# EasyEDA Pro project F405_飞控mini_2025-11-19.epro

# Schematic F405mini飞控原理图
Board Name: 飞控mini; Create Date: 2025-03-17; Page Name: mini; Project Name: F405空心杯飞控; Schematic Name: F405mini飞控原理图; Update Date: 2025-11-16; Company: 嘉立创EDA; Page Size: A4; Version: V1.0
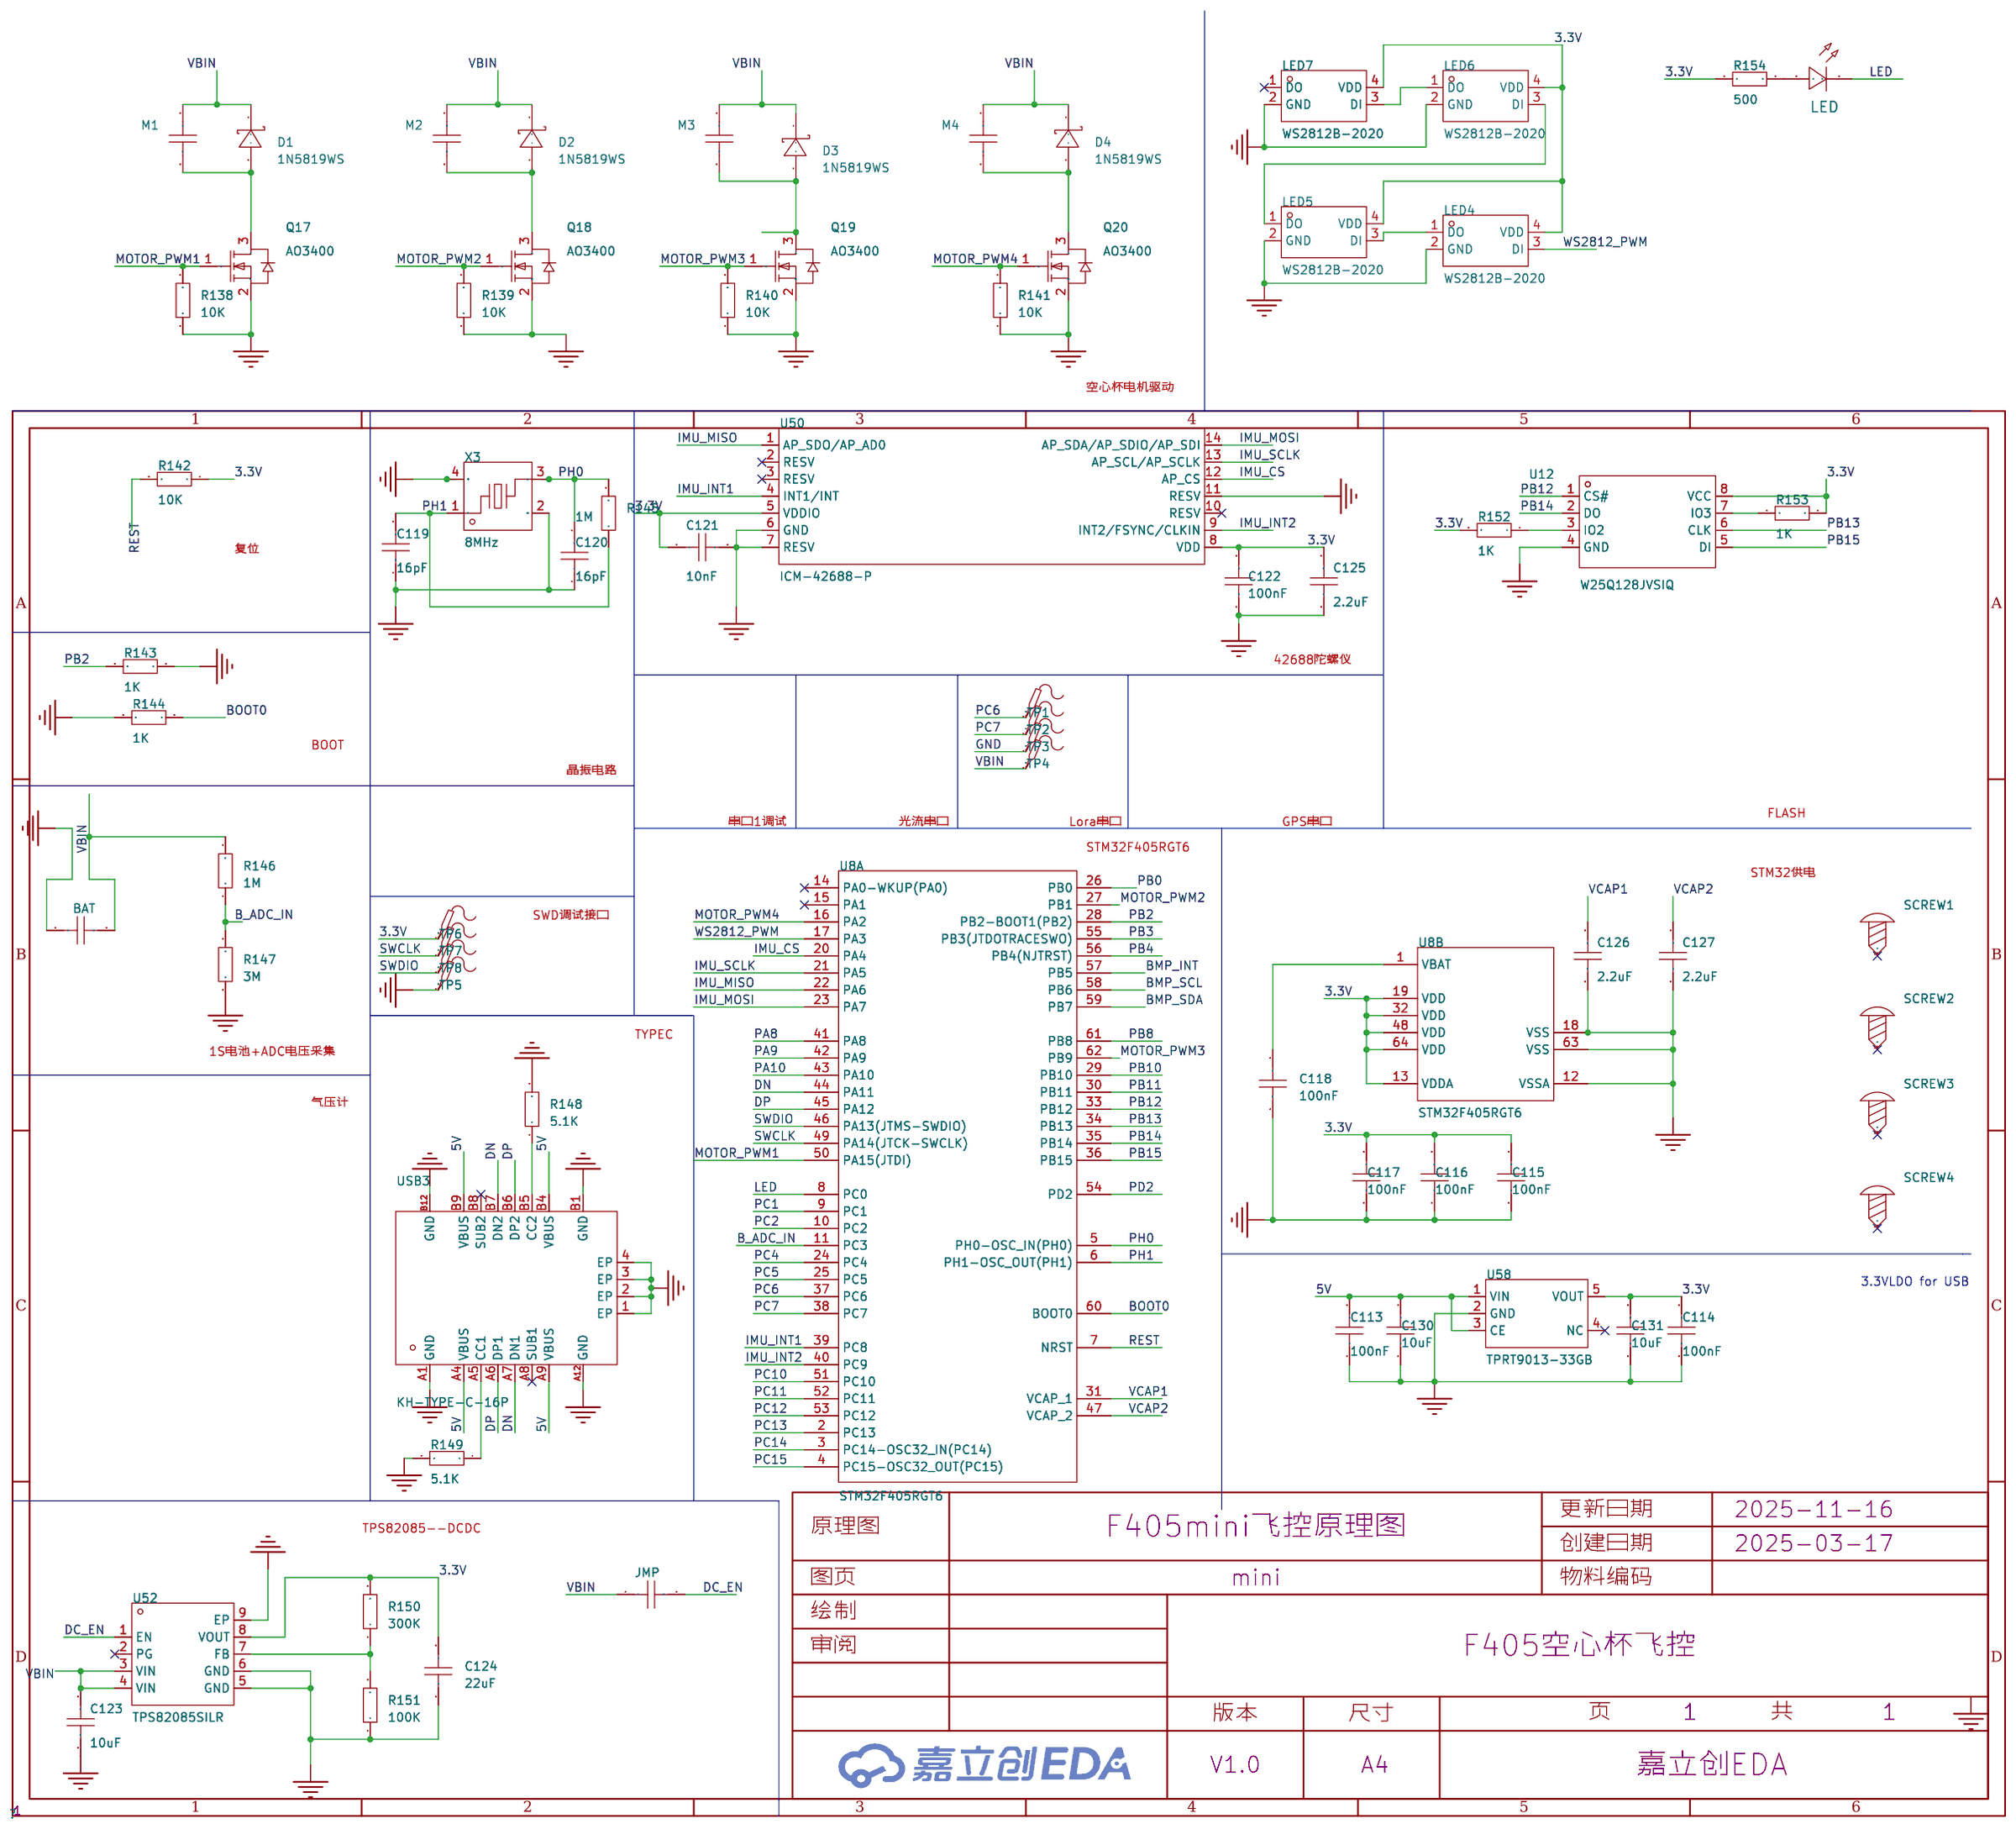
[diagram p0: schematic sheet]

## Parts
BAT  3.9nF  [C1812]
C113  100nF  [C0402]
C114  100nF  [C0402]
C115  100nF  [C0402]
C116  100nF  [C0402]
C117  100nF  [C0402]
C118  100nF  [C0402]
C119  16pF  [C0402]
C120  16pF  [C0402]
C121  10nF  [C0402]
C122  100nF  [C0402]
C123  10uF  [C0402]
C124  22uF  [C0603]
C125  2.2uF  [C0402]
C126  2.2uF  [C0402]
C127  2.2uF  [C0402]
C130  10uF  [C0402]
C131  10uF  [C0402]
D1  1N5819WS  [SOD-323_L1.8-W1.3-LS2.5-RD]
D2  1N5819WS  [SOD-323_L1.8-W1.3-LS2.5-RD]
D3  1N5819WS  [SOD-323_L1.8-W1.3-LS2.5-RD]
D4  1N5819WS  [SOD-323_L1.8-W1.3-LS2.5-RD]
JMP  100nF  [C0805]
LED  -  [LED_0603]
LED4  WS2812B-2020  [LED-SMD_4P-L2.0-W2.0-TL_WS2812B-2020]
LED5  WS2812B-2020  [LED-SMD_4P-L2.0-W2.0-TL_WS2812B-2020]
LED6  WS2812B-2020  [LED-SMD_4P-L2.0-W2.0-TL_WS2812B-2020]
LED7  WS2812B-2020  [LED-SMD_4P-L2.0-W2.0-TL_WS2812B-2020]
M1  100nF  [C1206]
M2  100nF  [C1206]
M3  100nF  [C1206]
M4  100nF  [C1206]
Q17  AO3400  [SOT-23_L2.9-W1.3-P1.90-LS2.4-BR]
Q18  AO3400  [SOT-23_L2.9-W1.3-P1.90-LS2.4-BR]
Q19  AO3400  [SOT-23_L2.9-W1.3-P1.90-LS2.4-BR]
Q20  AO3400  [SOT-23_L2.9-W1.3-P1.90-LS2.4-BR]
R138  10K  [R0402]
R139  10K  [R0402]
R140  10K  [R0402]
R141  10K  [R0402]
R142  10K  [R0402]
R143  1K  [R0402]
R144  1K  [R0402]
R145  1M  [R0402]
R146  1M  [R0402]
R147  3M  [R0402]
R148  5.1K  [R0402]
R149  5.1K  [R0402]
R150  300K  [R0402]
R151  100K  [R0402]
R152  1K  [R0402]
R153  1K  [R0402]
R154  500  [R0402]
SCREW1  -  [M2螺丝]
SCREW2  -  [M2螺丝]
SCREW3  -  [M2螺丝]
SCREW4  -  [M2螺丝]
TP1  -  [Test-Point-0.5mm]
TP2  -  [Test-Point-0.5mm]
TP3  -  [Test-Point-0.5mm]
TP4  -  [Test-Point-0.5mm]
TP5  -  [Test-Point-0.5mm]
TP6  -  [Test-Point-0.5mm]
TP7  -  [Test-Point-0.5mm]
TP8  -  [Test-Point-0.5mm]
U8  STM32F405RGT6  [LQFP-64_L10.0-W10.0-P0.50-LS12.0-BL]  (sections 1,2)
U12  W25Q128JVSIQ  [SOIC-8_L5.3-W5.3-P1.27-LS8.0-BL]
U50  ICM-42688-P  [LGA-14_L3.0-W2.5-P0.50-TL]
U52  TPS82085SILR  [USIP-8_L3.0-W2.8-P0.65-BL-EP]
U58  TPRT9013-33GB  [SOT-23-5_L3.0-W1.7-P0.95-LS2.8-BL]
USB3  KH-TYPE-C-16P  [USB-C-SMD_KH-TYPE-C-16P]
X3  8MHz  [CRYSTAL-SMD_4P-L3.2-W2.5-BL]

## Library data of the parts
BAT = FV43X392K202EFG: 容值:3.9nF;精度:±10%;额定电压:2kV;温度系数:X7R;; LCSC Part Name: 3.9nF ±10% 2kV; Supplier Part: C5144754; Manufacturer: PSA(信昌电陶); Supplier Footprint: 1812; JLCPCB Part Class: 扩展库; Datasheet: https://item.szlcsc.com/datasheet/FV43X392K202EFG/5766328.html; Supplier: LCSC; Tolerance: ±10%; Voltage Rating: 2kV; Temperature Coefficient: X7R
C113-C123 C125-C127 C130 C131 = CAP_0402: Supplier Footprint: 0402
C124 = CAP_0603: Supplier Footprint: 0603
D1-D4 = 1N5819WS_C191023: 正向压降(Vf):600mV@1A;直流反向耐压(Vr):40V;整流电流:1A;; LCSC Part Name: 电压:40V 电流:1A; Supplier Part: C191023; Manufacturer: Hottech(合科泰); Supplier Footprint: SOD-323; JLCPCB Part Class: 基础库; Datasheet: https://item.szlcsc.com/datasheet/1N5819WS/213850.html; Supplier: LCSC; Voltage - Forward(Vf@If): 600mV@1A; Voltage - DC Reverse(Vr): 40V; Current - Rectified: 1A; Non-Repetitive Peak Forward Surge Current: 25A
JMP = CAP_0805: Supplier Footprint: 0805
LED = LED_0603-R: Supplier Footprint: 0603
LED4-LED7 = WS2812B-2020: 12mA，小尺寸，高亮，用于小间距，小尺寸产品（注意防潮，请查阅规格书中对应具体内容）; LCSC Part Name: RGB三色; Supplier Part: C965555; Manufacturer: worldsemi; Supplier Footprint: SMD,2.2x2mm; JLCPCB Part Class: 扩展库; Datasheet: https://item.szlcsc.com/datasheet/WS2812B-2020/1051115.html; Supplier: LCSC; Wavelength: 515.6nm；622.5nm；470.4nm; Luminous Intensity: 200mcd；160mcd；520mcd; Data Transmission Rate: 100KB/S; Voltage - Supply: 5V; Installation method: 正贴
M1-M4 = CAP_1206: Supplier Footprint: 1206
Q17-Q20 = AO3400_C2938367: 数量:1个N沟道;漏源电压(Vdss):30V;连续漏极电流(Id):5.8A;导通电阻(RDS(on)):28mΩ@10V;耗散功率(Pd):1.5W;阈值电压(Vgs(th)):1.4V@250uA;; LCSC Part Name: 1个N沟道 耐压:30V 电流:5.8A; Supplier Part: C2938367; Manufacturer: GOODWORK(固得沃克); Supplier Footprint: SOT-23; JLCPCB Part Class: 扩展库; Datasheet: https://item.szlcsc.com/datasheet/AO3400/3294704.html; Supplier: LCSC; Number: 1个N沟道; Drain to Source Voltage: 30V; Current - Continuous Drain(Id): 5.8A; RDS(on): 28mΩ@10V; Pd - Power Dissipation: 1.5W; Gate Threshold Voltage (Vgs(th)): 1.4V@250uA; Input Capacitance(Ciss): 1.05nF; Reverse Transfer Capacitance (Crss@Vds): 77pF@15V; Operating Temperature: -55℃~+150℃; Type: N沟道
R138-R154 = Res_0402: Supplier Footprint: 0402
SCREW1-SCREW4 = M2螺丝: Supplier Footprint: 插件
TP1-TP8 = Test-Point: Test Point 测试点
U8 = STM32F405RGT6: CPU内核:ARM-M4;程序存储容量:1MB;RAM总容量:192KB;GPIO端口数量:51;工作电压范围:1.8V~3.6V;CPU最大主频:168MHz;程序存储器类型:FLASH;; LCSC Part Name: 带DSP和FPU的高性能基础系列ARM Cortex-M4 MCU，具有1 MB Flash、168 MHz CPU和ART加速器; Supplier Part: C15742; Manufacturer: ST(意法半导体); Supplier Footprint: LQFP-64(10x10); JLCPCB Part Class: 扩展库; Datasheet: https://atta.szlcsc.com/upload/public/pdf/source/20140801/1457707197138.pdf; Supplier: LCSC; CPU Core: ARM-M4; Program Storage Size: 1MB; RAM Size: 192KB; GPIO Ports Number: 51; Operating Voltage Range: 1.8V~3.6V; CPU Maximum Speed: 168MHz; Program Memory Type: FLASH; Operating Temperature Range: -40℃~+85℃; ADC (Bit): 12bit; DAC (Bit): 12bit; Universal Serial Bus: 有; Peripheral/Function: DMA；LCD/LED驱动；PWM; Watchdog: 有; Infrared Data Association: 有; Low-Voltage Detect: 有; LCD Module: 有; Direct Memory Access: 有; Internal Oscillator: 有
U12 = W25Q128JVSIQ: 接口类型:-;存储容量:128Mbit;时钟频率(fc):-;; LCSC Part Name: W25Q128JVSIQ 编带; Supplier Part: C97521; Manufacturer: WINBOND(华邦); Supplier Footprint: SOIC-8-208mil; JLCPCB Part Class: 基础库; Datasheet: https://atta.szlcsc.com/upload/public/pdf/source/20170316/1489627409956.pdf; Supplier: LCSC; Memory Size: 128Mbit
U50 = ICM-42688-P: 传感器类型:加速度计陀螺仪;; Supplier Part: C1850418; Manufacturer: TDK InvenSense(应美盛); Supplier Footprint: LGA-14(2.5x3); JLCPCB Part Class: 扩展库; Datasheet: https://atta.szlcsc.com/upload/public/pdf/source/20210703/CF24204867ACE5B754A2B035F23E5931.pdf; Supplier: LCSC; Sensor Type: 加速度计陀螺仪
U52 = TPS82085SILR: TPS82085 集成感应器的 3A 降压转换器（截面 &lt; 1.3mm）; Supplier Part: C465728; Manufacturer: TI(德州仪器); Supplier Footprint: USIP-8; JLCPCB Part Class: 扩展库; Datasheet: https://www.ti.com/cn/lit/gpn/tps82085; Supplier: LCSC
U58 = TPRT9013-33GB: 输出类型:固定;工作电压:7V;输出电压:3.3V;输出电流:500mA;电源纹波抑制比(PSRR):70dB@(1kHz);输出极性:正极;; LCSC Part Name: 500mA高电源抑制比电压调节器; Supplier Part: C587158; Manufacturer: TECH PUBLIC(台舟); Supplier Footprint: SOT-23-5; JLCPCB Part Class: 扩展库; Datasheet: https://item.szlcsc.com/datasheet/TPRT9013-33GB/616992.html; Supplier: LCSC; Output Type: 固定; Voltage - Supply: 7V; Output Voltage: 3.3V; Output Current: 500mA; Power Supply Rejection Ratio (PSRR): 70dB@(1kHz); Voltage Dropout: 300mV@(200mA); standby current: 60uA; Noise: 50uVrms; Features: 带使能; Operating Temperature: -40℃~+85℃@(Ta); Output Configuration: 正极; Number of Outputs: 1
USB3 = KH-TYPE-C-16P: 连接器类型:Type-C;标准:-;公母:母;端口数量:1;触点数量:16P;安装方式:卧贴;额定电流 - 电源:3A;工作温度范围:-40℃~+85℃;; LCSC Part Name: Type-C 母 卧贴; Supplier Part: C709357; Manufacturer: kinghelm(金航标); Supplier Footprint: SMD; JLCPCB Part Class: 扩展库; Datasheet: https://atta.szlcsc.com/upload/public/pdf/source/20200911/C709357_AA8DCEB38BB20E3035A7ED7AE7667837.pdf; Supplier: LCSC; Connector Type: Type-C; Gender: 母; Number of Ports: 1; Number of Contacts: 16P; Mounting Style: 卧贴; Current Rating - Power (Max): 3A; Operating Temperature Range: -40℃~+85℃
X3 = X32258MSB4SI: 晶振类型:贴片晶振;频率:8MHz;常温频差:±10ppm;外接负载电容:20pF;频率稳定度(全温):±20ppm;; LCSC Part Name: 8MHz ±10ppm 20pF; Supplier Part: C2682774; Manufacturer: YXC(扬兴晶振); Supplier Footprint: SMD3225-4P; JLCPCB Part Class: 扩展库; Datasheet: https://atta.szlcsc.com/upload/public/pdf/source/20240329/19D5F850207469550BEB00D7DFEDBC7A.pdf; Supplier: LCSC; Crystal Type: 贴片晶振; Normal temperature Frequency Tolerance: ±10ppm; External load capacitor: 20pF; Frequency Stability(Full temperature range): ±20ppm; Operating Temperature: -40℃~+85℃

## Nets
3.3V: C114.2 C115.2 C116.2 C117.2 C121.1 C122.2 C124.2 C125.2 C131.2 LED4.4(VDD) LED5.4(VDD) LED6.4(VDD) LED7.4(VDD) R142.1 R150.2 R152.2 R153.1 R154.1 TP6.1 U8.13(VDDA) U8.19(VDD) U8.32(VDD) U8.48(VDD) U8.64(VDD) U12.8(VCC) U50.5(VDDIO) U50.8(VDD) U52.8(VOUT) U58.5(VOUT)
5V: C113.2 C130.2 U58.1(VIN) U58.3(CE) USB3.A4(VBUS) USB3.A9(VBUS) USB3.B4(VBUS) USB3.B9(VBUS)
GND: BAT.1 C113.1 C114.1 C115.1 C116.1 C117.1 C118.1 C119.1 C120.1 C121.2 C122.1 C123.1 C124.1 C125.1 C126.1 C127.1 C130.1 C131.1 LED4.2(GND) LED5.2(GND) LED6.2(GND) LED7.2(GND) Q17.2(S) Q18.2(S) Q19.2(S) Q20.2(S) R138.1 R139.1 R140.1 R141.1 R143.1 R144.2 R147.1 R148.2 R149.2 R151.1 TP3.1 TP5.1 U8.12(VSSA) U8.18(VSS) U8.63(VSS) U12.4(GND) U50.6(GND) U50.7(RESV) U50.11(RESV) U52.5(GND) U52.6(GND) U52.9(EP) U58.2(GND) USB3.1(EP) USB3.2(EP) USB3.3(EP) USB3.4(EP) USB3.A1(GND) USB3.A12(GND) USB3.B1(GND) USB3.B12(GND) X3.2(GND) X3.4(GND)
B_ADC_IN: R146.1 R147.2 U8.11(PC3)
BMP_INT: U8.57(PB5)
BMP_SCL: U8.58(PB6)
BMP_SDA: U8.59(PB7)
BOOT0: R144.1 U8.60(BOOT0)
DC_EN: JMP.2 U52.1(EN)
DN: U8.44(PA11) USB3.A7(DN1) USB3.B7(DN2)
DP: U8.45(PA12) USB3.A6(DP1) USB3.B6(DP2)
IMU_CS: U8.20(PA4) U50.12(AP_CS)
IMU_INT1: U8.39(PC8) U50.4(INT1/INT)
IMU_INT2: U8.40(PC9) U50.9(INT2/FSYNC/CLKIN)
IMU_MISO: U8.22(PA6) U50.1(AP_SDO/AP_AD0)
IMU_MOSI: U8.23(PA7) U50.14(AP_SDA/AP_SDIO/AP_SDI)
IMU_SCLK: U8.21(PA5) U50.13(AP_SCL/AP_SCLK)
LED: LED.1(C) U8.8(PC0)
MOTOR_PWM1: Q17.1(G) R138.2 U8.50(PA15(JTDI))
MOTOR_PWM2: Q18.1(G) R139.2 U8.27(PB1)
MOTOR_PWM3: Q19.1(G) R140.2 U8.62(PB9)
MOTOR_PWM4: Q20.1(G) R141.2 U8.16(PA2)
PA8: U8.41(PA8)
PA9: U8.42(PA9)
PA10: U8.43(PA10)
PB0: U8.26(PB0)
PB2: R143.2 U8.28(PB2-BOOT1(PB2))
PB3: U8.55(PB3(JTDOTRACESWO))
PB4: U8.56(PB4(NJTRST))
PB8: U8.61(PB8)
PB10: U8.29(PB10)
PB11: U8.30(PB11)
PB12: U8.33(PB12) U12.1(CS#)
PB13: U8.34(PB13) U12.6(CLK)
PB14: U8.35(PB14) U12.2(DO)
PB15: U8.36(PB15) U12.5(DI)
PC1: U8.9(PC1)
PC2: U8.10(PC2)
PC4: U8.24(PC4)
PC5: U8.25(PC5)
PC6: TP1.1 U8.37(PC6)
PC7: TP2.1 U8.38(PC7)
PC10: U8.51(PC10)
PC11: U8.52(PC11)
PC12: U8.53(PC12)
PC13: U8.2(PC13)
PC14: U8.3(PC14-OSC32_IN(PC14))
PC15: U8.4(PC15-OSC32_OUT(PC15))
PD2: U8.54(PD2)
PH0: C120.2 R145.2 U8.5(PH0-OSC_IN(PH0)) X3.3
PH1: C119.2 R145.1 U8.6(PH1-OSC_OUT(PH1)) X3.1
REST: R142.2 U8.7(NRST)
SWCLK: TP7.1 U8.49(PA14(JTCK-SWCLK))
SWDIO: TP8.1 U8.46(PA13(JTMS-SWDIO))
VBIN: BAT.2 C123.2 D1.1(K) D2.1(K) D3.1(K) D4.1(K) JMP.1 M1.1 M2.1 M3.1 M4.1 R146.2 TP4.1 U52.3(VIN) U52.4(VIN)
VCAP1: C126.2 U8.31(VCAP_1)
VCAP2: C127.2 U8.47(VCAP_2)
WS2812_PWM: LED4.3(DI) U8.17(PA3)
$1N3956: C118.2 U8.1(VBAT)
$1N3964: R153.2 U12.7(IO3)
$1N3968: R152.1 U12.3(IO2)
$1N3991: R148.1 USB3.B5(CC2)
$1N4023: R149.1 USB3.A5(CC1)
$1N4073: R150.1 R151.2 U52.7(FB)
$1N11770: LED4.1(DO) LED5.3(DI)
$1N11775: LED5.1(DO) LED6.3(DI)
$1N11782: LED6.1(DO) LED7.3(DI)
$1N15181: LED.2(A) R154.2
Net-(D1-2): D1.2(A) M1.2 Q17.3(D)
Net-(D2-2): D2.2(A) M2.2 Q18.3(D)
Net-(D3-2): D3.2(A) M3.2 Q19.3(D)
Net-(D4-2): D4.2(A) M4.2 Q20.3(D)

Not connected (* = marked no-connect by the designer): LED7 1(DO)*; SCREW1 1*; SCREW2 1*; SCREW3 1*; SCREW4 1*; U8 14(PA0-WKUP(PA0))* 15(PA1)*; U50 2(RESV)* 3(RESV)* 10(RESV)*; U52 2(PG)*; U58 4(NC)*; USB3 A8(SUB1)* B8(SUB2)*

## Notes on the sheet
- 空心杯电机驱动
- 复位
- 42688陀螺仪
- BOOT
- 晶振电路
- FLASH
- 串口1调试
- 光流串口
- Lora串口
- GPS串口
- STM32F405RGT6
- STM32供电
- SWD调试接口
- TYPEC
- 1S电池+ADC电压采集
- 气压计
- 3.3VLDO for USB
- TPS82085--DCDC

# Board PCB3
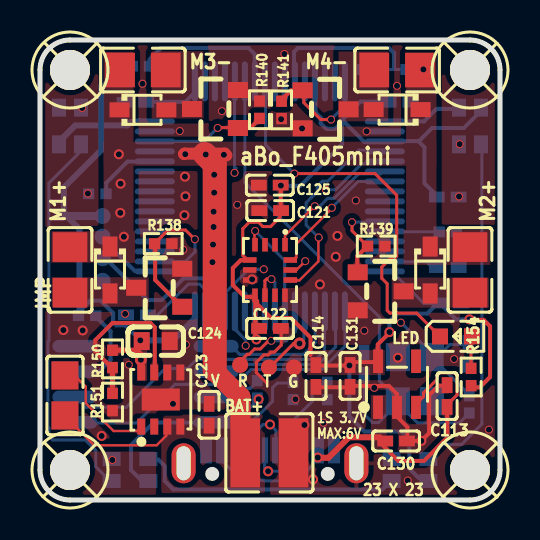
[diagram p1: board, top side]
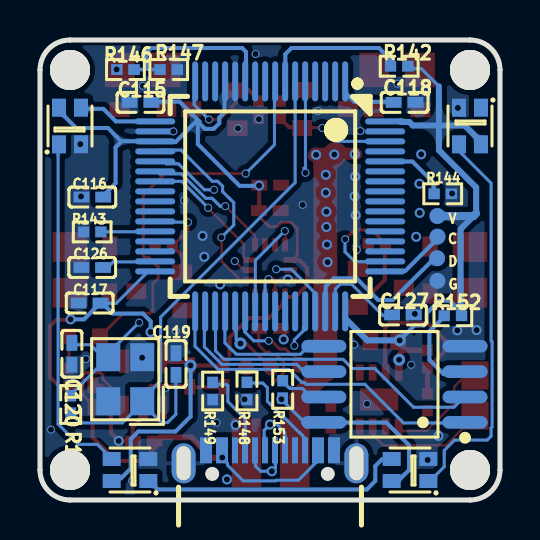
[diagram p2: board, bottom side, seen from below]

Outline 23 x 23 mm; copper layers: Top Layer, GND, Inner2, Bottom Layer. Coordinates in mm from the lower left corner of the outline.
Outline path: 0,21.5 0,1.5 arc(0.44,0.44) 1.5,0 21.5,0 arc(22.56,0.44) 23,1.5 23,21.5 arc(22.56,22.56) 21.5,23 1.5,23 arc(0.44,22.56) 0,21.5
Stack: Top Layer 0.035mm 外层铜厚1oz / Dielectric1 0.2104mm 7628 RC49% 8.6mil / GND 0.0152mm 内层铜厚 / Dielectric2 1.065mm 1.1mm H/HOZ Copper / Inner2 0.0152mm 内层铜厚 / Dielectric3 0.2104mm 7628 RC49% 8.6mil / Bottom Layer 0.035mm 外层铜厚1oz

## Design rules (mm)
template: 自定义配置
spacing copperThickness1oz (default): track to track 0.102, other pairs 0.152 to 0.3
spacing copperThickness2oz: track to track 0.203, other pairs 0.152 to 0.3
spacing copperThicknessInner0.5oz: track to track 0.089, other pairs 0.152 to 0.3
track width copperThickness1oz (default): min 0.102, default 0.254, max 2.54
track width copperThickness2oz: min 0.203, default 0.254, max 2.54
track width copperThickness0.5oz: min 0.089, default 0.254, max 2.54
differential pair differentialPair (default): width min 0.127, default 0.254, max 2.54; gap min 0.152, default 0.152
via viaSize (default): diameter min 0.3, default 0.61, max 10; hole min 0.2, default 0.305, max 6.3
net GND uses 全连接
pour e193 uses 全连接
pour e1787 uses 全连接

## Placement (name value [footprint] x y rotation side)
BAT+  3.9nF  [C1812]  11.5 2.36 180 top
C  -  [Test-Point-0.5mm]  3.13 13.17 180 bottom
C113  100nF  [C0402]  20.36 5.2 270 top
C114  100nF  [C0402]  13.8 6.2 90 top
C115  100nF  [C0402]  17.98 19.88 180 bottom
C116  100nF  [C0402]  20.38 15.15 180 bottom
C117  100nF  [C0402]  20.52 9.85 180 bottom
C118  100nF  [C0402]  4.77 19.88 0 bottom
C119  16pF  [C0402]  16.2 6.8 270 bottom
C120  16pF  [C0402]  21.41 7.31 90 bottom
C121  10nF  [C0402]  11.51 14.47 180 top
C122  100nF  [C0402]  11.5 8.58 180 top
C123  10uF  [C0402]  8.45 4.26 270 top
C124  22uF  [C0603]  5.78 7.94 180 top
C125  2.2uF  [C0402]  11.49 15.74 0 top
C126  2.2uF  [C0402]  20.39 11.63 180 bottom
C127  2.2uF  [C0402]  4.85 9.25 0 bottom
C130  10uF  [C0402]  17.81 2.95 180 top
C131  10uF  [C0402]  15.5 6.2 90 top
D  -  [Test-Point-0.5mm]  3.15 12.09 180 bottom
D1  1N5819WS  [SOD-323_L1.8-W1.3-LS2.5-RD]  3.5 11.5 270 top
D2  1N5819WS  [SOD-323_L1.8-W1.3-LS2.5-RD]  19.51 11.5 270 top
D3  1N5819WS  [SOD-323_L1.8-W1.3-LS2.5-RD]  5.15 19.51 0 top
D4  1N5819WS  [SOD-323_L1.8-W1.3-LS2.5-RD]  17.86 19.52 180 top
G  -  [Test-Point-0.5mm]  3.13 10.96 180 bottom
JMP  100nF  [C0805]  1.25 5.23 90 top
LED  -  [LED_0603]  20.85 8.19 0 top
LED4  WS2812B-2020  [LED-SMD_4P-L2.0-W2.0-TL_WS2812B-2020]  21.5 18.7 90 bottom
LED5  WS2812B-2020  [LED-SMD_4P-L2.0-W2.0-TL_WS2812B-2020]  18.5 1.5 0 bottom
LED6  WS2812B-2020  [LED-SMD_4P-L2.0-W2.0-TL_WS2812B-2020]  4.5 1.5 0 bottom
LED7  WS2812B-2020  [LED-SMD_4P-L2.0-W2.0-TL_WS2812B-2020]  1.5 18.7 270 bottom
M1+  100nF  [C1206]  1.5 11.5 270 top
M2+  100nF  [C1206]  21.5 11.5 270 top
M3-  100nF  [C1206]  5.15 21.5 0 top
M4-  100nF  [C1206]  17.85 21.5 180 top
Q17  AO3400  [SOT-23_L2.9-W1.3-P1.90-LS2.4-BR]  5.96 10.61 0 top
Q18  AO3400  [SOT-23_L2.9-W1.3-P1.90-LS2.4-BR]  17.03 10.44 180 top
Q19  AO3400  [SOT-23_L2.9-W1.3-P1.90-LS2.4-BR]  8.74 19.55 0 top
Q20  AO3400  [SOT-23_L2.9-W1.3-P1.90-LS2.4-BR]  14.28 19.53 180 top
R138  10K  [R0402]  6.16 12.82 180 top
R139  10K  [R0402]  16.81 12.69 180 top
R140  10K  [R0402]  10.97 19.51 270 top
R141  10K  [R0402]  12.08 19.51 90 top
R142  10K  [R0402]  5.04 21.69 0 bottom
R143  1K  [R0402]  20.39 13.41 180 bottom
R144  1K  [R0402]  2.86 15.31 180 bottom
R145  1M  [R0402]  21.46 4.78 90 bottom
R146  1M  [R0402]  18.73 21.52 0 bottom
R147  3M  [R0402]  16.56 21.52 0 bottom
R148  5.1K  [R0402]  12.65 5.45 270 bottom
R149  5.1K  [R0402]  14.37 5.45 270 bottom
R150  300K  [R0402]  3.63 7.06 90 top
R151  100K  [R0402]  3.63 4.9 90 top
R152  1K  [R0402]  2.36 9.21 180 bottom
R153  1K  [R0402]  10.87 5.53 90 bottom
R154  500  [R0402]  21.56 6.15 90 top
SCREW1  -  [M2螺丝]  1.5 21.5 0 top
SCREW2  -  [M2螺丝]  21.5 21.5 0 top
SCREW3  -  [M2螺丝]  1.5 1.5 0 top
SCREW4  -  [M2螺丝]  21.5 1.5 0 top
TP1  -  [Test-Point-0.5mm]  11.45 6.63 180 top
TP2  -  [Test-Point-0.5mm]  10.01 6.75 180 top
TP3  -  [Test-Point-0.5mm]  12.7 6.63 180 top
TP4  -  [Test-Point-0.5mm]  8.75 6.75 180 top
U8  STM32F405RGT6  [LQFP-64_L10.0-W10.0-P0.50-LS12.0-BL]  11.49 15.18 0 bottom
U12  W25Q128JVSIQ  [SOIC-8_L5.3-W5.3-P1.27-LS8.0-BL]  5.28 5.78 90 bottom
U50  ICM-42688-P  [LGA-14_L3.0-W2.5-P0.50-TL]  11.5 11.5 270 top
U52  TPS82085SILR  [USIP-8_L3.0-W2.8-P0.65-BL-EP]  6.04 5.02 270 top
U58  TPRT9013-33GB  [SOT-23-5_L3.0-W1.7-P0.95-LS2.8-BL]  17.85 5.78 0 top
USB3  KH-TYPE-C-16P  [USB-C-SMD_KH-TYPE-C-16P]  11.5 0.07 180 bottom
V  -  [Test-Point-0.5mm]  3.13 14.2 180 bottom
X3  8MHz  [CRYSTAL-SMD_4P-L3.2-W2.5-BL]  18.74 6.04 90 bottom

## Footprints (pads in the part's own frame, mm; a bottom-side part is the same pattern mirrored in y, then rotated)
C0402
  rect 0.79x0.54 smd: 1(-0.545,0) 2(0.545,0)
C0603
  rect 0.8x0.9 smd: 1(-0.7,0) 2(0.7,0)
C0805
  rect 1.41x1.35 smd: 1(-1,0) 2(1,0)
C1206
  rect 1.485x1.728 smd: 1(-1.148,0) 2(1.135,0)
C1812
  rect 1.485x3.456 smd: 1(-1.175,0) 2(1.238,0)
CRYSTAL-SMD_4P-L3.2-W2.5-BL
  rect 1.4x1.2 smd: 1(-1.1,-0.85) 2(1.1,-0.85) 3(1.1,0.85) 4(-1.1,0.85)
LED-SMD_4P-L2.0-W2.0-TL_WS2812B-2020
  rect 0.9x0.7 smd: 1(-0.915,0.55) 2(-0.915,-0.55) 3(0.915,-0.55) 4(0.915,0.55)
LED_0603
  rect 0.8x0.8 smd: 1(-0.851,-0.01) 2(0.75,-0.005)
LGA-14_L3.0-W2.5-P0.50-TL
  rect 0.675x0.28 smd: 1(-1.262,0.75) 2(-1.262,0.25) 3(-1.262,-0.25) 4(-1.262,-0.75) 8(1.262,-0.75) 9(1.262,-0.25) 10(1.262,0.25) 11(1.262,0.75)
  rect 0.28x0.675 smd: 5(-0.5,-1.012) 6(0,-1.012) 7(0.5,-1.012) 12(0.5,1.012) 13(0,1.012) 14(-0.5,1.012)
LQFP-64_L10.0-W10.0-P0.50-LS12.0-BL
  oval 0.3x2 smd: 1(-3.75,-5.75) 2(-3.25,-5.75) 3(-2.75,-5.75) 4(-2.25,-5.75) 5(-1.75,-5.75) 6(-1.25,-5.75) 7(-0.75,-5.75) 8(-0.25,-5.75) 9(0.25,-5.75) 10(0.75,-5.75) 11(1.25,-5.75) 12(1.75,-5.75) 13(2.25,-5.75) 14(2.75,-5.75) 15(3.25,-5.75) 16(3.75,-5.75) 33(3.75,5.75) 34(3.25,5.75) 35(2.75,5.75) 36(2.25,5.75) 37(1.75,5.75) 38(1.25,5.75) 39(0.75,5.75) 40(0.25,5.75) 41(-0.25,5.75) 42(-0.75,5.75) 43(-1.25,5.75) 44(-1.75,5.75) 45(-2.25,5.75) 46(-2.75,5.75) 47(-3.25,5.75) 48(-3.75,5.75)
  oval 2x0.3 smd: 17(5.75,-3.75) 18(5.75,-3.25) 19(5.75,-2.75) 20(5.75,-2.25) 21(5.75,-1.75) 22(5.75,-1.25) 23(5.75,-0.75) 24(5.75,-0.25) 25(5.75,0.25) 26(5.75,0.75) 27(5.75,1.25) 28(5.75,1.75) 29(5.75,2.25) 30(5.75,2.75) 31(5.75,3.25) 32(5.75,3.75) 49(-5.75,3.75) 50(-5.75,3.25) 51(-5.75,2.75) 52(-5.75,2.25) 53(-5.75,1.75) 54(-5.75,1.25) 55(-5.75,0.75) 56(-5.75,0.25) 57(-5.75,-0.25) 58(-5.75,-0.75) 59(-5.75,-1.25) 60(-5.75,-1.75) 61(-5.75,-2.25) 62(-5.75,-2.75) 63(-5.75,-3.25) 64(-5.75,-3.75)
M2螺丝
  round 2 hole 2: 1(0,0)
R0402
  rect 0.566x0.54 smd: 1(-0.433,0) 2(0.433,0)
SOD-323_L1.8-W1.3-LS2.5-RD
  rect 1x0.75 smd: 1(-1.173,0) 2(1.173,0)
SOIC-8_L5.3-W5.3-P1.27-LS8.0-BL
  oval 0.63x2.25 smd: 1(-1.905,-3.53) 2(-0.635,-3.53) 3(0.635,-3.53) 4(1.905,-3.53) 5(1.905,3.53) 6(0.635,3.53) 7(-0.635,3.53) 8(-1.905,3.53)
SOT-23-5_L3.0-W1.7-P0.95-LS2.8-BL
  rect 0.49x1.157 smd: 1(-0.95,-1.153) 2(0,-1.153) 3(0.95,-1.153)
  rect 0.49x1.175 smd: 4(0.95,1.153) 5(-0.95,1.153)
SOT-23_L2.9-W1.3-P1.90-LS2.4-BR
  rect 1x0.8 smd: 1(1.15,-0.95) 2(1.15,0.95) 3(-1.15,0)
Test-Point-0.5mm
  round 0.8 smd: 1(0,0)
USB-C-SMD_KH-TYPE-C-16P
  oval 1.2x2 hole 0.7x1.7: 1(-4.32,1.765) 2(4.32,1.765)
  rect 0.3x1.3 smd: A1(-3.35,2.415) A4(-2.55,2.415) A5(-1.25,2.415) A6(-0.25,2.415) A7(0.25,2.415) A8(1.25,2.415) A9(2.55,2.415) A12(3.35,2.415) B1(3.05,2.415) B4(2.25,2.415) B5(1.75,2.415) B6(0.75,2.415) B7(-0.75,2.415) B8(-1.75,2.415) B9(-2.25,2.415) B12(-3.05,2.415)
USIP-8_L3.0-W2.8-P0.65-BL-EP
  rect 0.8x0.4 smd: 1(1.351,-0.975) 2(1.351,-0.325) 3(1.351,0.325) 4(1.351,0.975) 5(-1.351,0.975) 6(-1.351,0.325) 7(-1.351,-0.325) 8(-1.351,-0.975)
  rect 1.1x1.9 smd: 9(0,0)

## Nets
As in the schematic, except:
3.3V: C114.2 C115.2 C116.2 C117.2 C121.1 C122.2 C124.2 C125.2 C131.2 LED4.4 LED5.4 LED6.4 LED7.4 R142.1 R150.2 R152.2 R153.1 R154.1 U8.13 U8.19 U8.32 U8.48 U8.64 U12.8 U50.5 U50.8 U52.8 U58.5 V.1
GND: BAT+.1 C113.1 C114.1 C115.1 C116.1 C117.1 C118.1 C119.1 C120.1 C121.2 C122.1 C123.1 C124.1 C125.1 C126.1 C127.1 C130.1 C131.1 G.1 LED4.2 LED5.2 LED6.2 LED7.2 Q17.2 Q18.2 Q19.2 Q20.2 R138.1 R139.1 R140.1 R141.1 R143.1 R144.2 R147.1 R148.2 R149.2 R151.1 TP3.1 U8.12 U8.18 U8.63 U12.4 U50.6 U50.7 U50.11 U52.5 U52.6 U52.9 U58.2 USB3.1 USB3.2 USB3.A1 USB3.A12 USB3.B1 USB3.B12 X3.2 X3.4
SWCLK: C.1 U8.49
SWDIO: D.1 U8.46
VBIN: BAT+.2 C123.2 D1.1 D2.1 D3.1 D4.1 JMP.1 M1+.1 M2+.1 M3-.1 M4-.1 R146.2 TP4.1 U52.3 U52.4
$1N4128: D1.2 M1+.2 Q17.3
$1N4137: D2.2 M2+.2 Q18.3
$1N4155: D4.2 M4-.2 Q20.3
$1N14614: D3.2 M3-.2 Q19.3

Pads without a net: LED7 1; SCREW1 1; SCREW2 1; SCREW3 1; SCREW4 1; U8 14 15; U50 2 3 10; U52 2; U58 4; USB3 A8 B8

## Via types
v1: diameter 0.4, hole 0.305, Top Layer to Bottom Layer, 45 vias
v2: diameter 0.5, hole 0.305, Top Layer to Bottom Layer, 35 vias
v3: diameter 0.6, hole 0.305, Top Layer to Bottom Layer, 4 vias

## Routing (per net, layer and track width the routed paths; a pad name or vN(x,y) marks a point on that pad's centre or on a via; arc(x,y) is an arc through that point)
3.3V: length 113.2
  Top Layer w0.15: 10.33,12.04 10.14,12.23 10.14,13.57 10.46,13.88 10.93,13.88 11.14,13.67 11.53,13.67 12,14.14 12,14.28 12.13,14.41 12.14,14.41 ; 10.49,12.04 10.46,12.04
  Top Layer w0.2: 21.48,9.01 22.19,9.01 22.5,8.69 22.5,6.15 21.98,5.63 21.52,5.63 ; 10.76,10.15 10.76,8.09 v2(10.82,8.03) ; 10.76,10.15 10.24,10.15 9.64,10.75 9.64,11.6 10.04,11.99 10.46,11.99 ; 10.76,10.15 10.77,10.15 ; 16.89,7 16.89,7.78 17.45,8.34 ; 15.52,6.74 15.68,6.89 16.87,6.89 ; 10.83,9.97 10.86,9.94 10.86,9.8 11.55,9.1 12.54,9.1 13.53,8.12 13.53,7.6 13.52,7.59 13.52,7.25 ; 15.53,6.72 13.8,6.72 ; 12.04,14.54 12.04,15.7 12.05,15.71
  Top Layer w0.254: R150.2 4.84,7.49 5.02,7.31 5.02,6.42 U52.8
  Inner2 w0.2: 5.09,7 5.12,7.03 9.14,7.03 9.79,7.68 9.79,7.92 10.04,8.17 10.67,8.17 v2(10.82,8.03)
  Inner2 w0.4: v2(10.82,8.03) 10.93,7.92 v2(10.93,5.04) 10.87,5.04
  Bottom Layer w0.15: 8.77,3.87 9.76,3.87 v2(10.93,5.04) ; 4.48,21.57 3.94,21.57 3.06,20.69 ; 19.87,9.83 19.19,9.83 17.64,11.38
  Bottom Layer w0.2: 18.94,17.94 19.6,18.6 21.19,18.6 22.08,19.49 ; 20.04,9.8 20.8,9.03 21.48,9.03 ; 19.35,1.09 18.95,1.09 18.46,1.58 18.46,3.05 18.09,3.42 16.23,3.42 15.47,4.18 15.47,6.73 ; 13.77,21.51 13.77,21.49 13.78,21.49 13.78,19.38 14.03,19.12 14.03,18.83 14.3,18.57 14.35,18.57 14.36,18.56 14.74,18.56 14.75,18.57 14.76,18.57 15.03,18.83 15.03,18.92 16.02,19.92 17.41,19.92 ; 5,8 4.27,8.73 3.81,8.73 3.66,8.88 3.66,9.34 3.03,9.97 2.51,9.97 1.98,9.44 ; 17.49,19.91 17.42,19.91 ; 17.47,8.4 17.47,8.93 17.85,9.32 19.36,9.32 19.87,9.83 ; 15.13,18.99 16.22,17.9 16.97,17.9 ; 17.71,17.94 18.92,17.94 19.22,17.64 19.22,15.84 19.87,15.19 ; 12.03,15.71 13.02,15.71 15.11,17.79 15.11,18.96 ; 5.45,1.03 5.02,1.03 4.55,1.5 4.55,2.74 5.68,3.87 8.17,3.87
  Bottom Layer w0.3: 3.05,18.73 1.76,18.73 0.94,17.91 ; 3.05,18.73 3.05,17.49 1.19,15.63 1.19,14.33 1.97,13.55 1.97,9.15 ; 3.05,18.73 4.36,18.73 4.53,18.9 4.94,18.9 4.98,18.94 ; 3.05,18.73 3.06,20.69 ; 5.01,7.98 6.64,7.98 7.74,9.08
  Bottom Layer w0.4: 1.19,14.33 1.32,14.2 3.1,14.2
  vias: v2(12.04,15.72) v2(17.47,8.4) v2(21.47,9.03) v3(5.01,7.98) v3(5.04,7.01) v3(15.47,6.73)
5V: length 19.7
  Top Layer w0.15: 18.76,4.76 19.18,5.18 19.18,5.36 19.86,6.04 19.86,6.23 19.99,6.37 20.72,6.37 20.85,6.23 20.85,5.26 20.35,4.75 20.35,4.59
  Top Layer w0.2: 17.11,3.02 17.11,3.11 ; 20.35,4.59 20.38,3.14 19.19,1.95 17.91,1.95 17.11,2.76
  Top Layer w0.3: 16.99,3.14 15.45,3.14 14.42,2.11 13.88,2.11
  Bottom Layer w0.15: 13.86,2.07 13.63,1.84 13.63,1.74 12.85,0.96 11.21,0.96 11.18,0.99 10.08,0.99 9.14,1.93 9.14,1.97
  vias: v2(13.89,2.12)
GND: length 14.9
  Top Layer w0.15: 11.53,7.36 11.42,7.25 11.19,7.25 10.82,6.89 10.82,6.37 11.33,5.86 11.33,5.84 ; 11.53,7.39 11.71,7.39 12.04,7.73 ; 12.06,7.73 12.06,8.49 12.04,8.52
  Top Layer w0.2: 13.73,5.64 15.55,5.64 ; 18.37,2.94 18.37,3.65 17.84,4.18 17.85,4.6 ; 18.37,2.94 18.36,2.94 ; 18.37,2.94 18.38,2.95 v2(19.07,2.95) 19.46,3.34 19.46,5.24 19.93,5.72 20.38,5.72 ; 18.37,2.94 18.37,2.92 ; 15.47,5.71 17.44,5.71 17.85,5.3 17.85,4.6 ; 17.85,4.6 17.85,4.56
  vias: v1(2.11,19.6) v1(2.39,15.33) v1(3.62,2) v1(4.26,9.31) v1(4.44,6.76) v1(5.12,20.81) v1(6.65,4.81) v1(6.99,18.45) v1(7.16,12.51) v1(7.29,7.77) v1(9.1,19.44) v1(9.87,14.76) v1(12.05,19.04) v1(12.22,22.3) v1(12.78,5.03) v1(13.1,18.58) v1(14.17,3.86) v1(15.79,14.97) v1(16.21,8.47) v1(16.33,18.43) v1(16.71,5.61) v1(17.85,20.71) v1(18.39,0.97) v1(20.71,7.05) v1(20.98,17.79) v1(20.95,15.18) v1(22.45,3.52) v2(1.17,8.5) v2(2.13,8.48) v2(3.08,3.2) v2(7.25,16.17) v2(7.22,14.24) v2(7.27,15.18) v2(10.61,11.03) v2(13.22,3.75) v2(13.65,1.03) v2(14,10.78) v2(14.79,12.16) v2(14.87,13.21) v2(17.89,7.11)
B_ADC_IN: length 8.7
  Bottom Layer w0.15: 16.99,21.52 18.28,21.52 18.3,21.55
  Bottom Layer w0.2: 12.7,21 12.7,22.4 12.89,22.6 17.45,22.6 17.7,22.35 17.7,21.61
BOOT0: length 3.4
  Bottom Layer w0.2: 3.31,15.21 3.31,15.86 4.38,16.92 5.63,16.92
DC_EN: length 5.2
  Top Layer w0.12: 5.11,3.69 4.87,3.45 3.68,3.45 2.29,4.84 2.29,5.67 1.89,6.06 1.6,6.06
DN: length 13
  Inner2 w0.15: v2(11.41,1.44) 9.57,1.44 8.64,2.37 8.64,6.07 v1(10.28,7.71)
  Bottom Layer w0.15: v1(10.28,7.71) 10.28,8 9.84,8.45 9.84,8.62 ; 12.23,2.42 12.23,1.7 11.97,1.44 v2(11.41,1.44) 11.23,1.62 11.23,2.47
DP: length 15.7
  Inner2 w0.15: 11.15,11.48 11.13,11.46 11.13,11.22 11.13,11.22 11.13,10.86 11.38,10.61 11.42,10.61 12.84,9.2 12.84,8.45 12.43,8.04 12.43,7.6 12.74,7.29 12.74,5.62 12.33,5.21 12.33,4.85 12.72,4.46 12.72,4.08 12.38,3.74 11.5,3.74 11.5,3.75
  Bottom Layer w0.15: v1(11.19,11.54) 10.44,11.54 9.26,10.36 ; 10.76,2.5 10.76,3.39 11.15,3.78 v2(11.5,3.78) 11.79,3.49 11.79,2.52
IMU_CS: length 9.8
  Top Layer w0.12: 13.92,13.09 13.92,11.93 12.97,10.98 12.64,10.98 12.63,10.98
  Bottom Layer w0.15: v1(13.93,13.13) 13.31,13.75 13.31,14.87 13.56,15.12 13.57,15.12 13.87,15.42 13.87,15.69 14.12,15.94 14.39,15.94 15.95,17.5 17.06,17.5
IMU_INT1: length 4.3
  Top Layer w0.12: 10.74,12.85 10.72,12.87 10.72,13.4
  Bottom Layer w0.15: 12.23,10.31 12.23,11.98 v1(10.76,13.45)
IMU_INT2: length 1.7
  Top Layer w0.15: 11.24,10.45 11.24,10.46 11.24,10.96 11.33,11.05 11.54,11.05
  Bottom Layer w0.15: v1(11.57,11.04) 11.74,10.87 11.74,10.27
IMU_MISO: length 6.6
  Top Layer w0.12: 13.73,14.69 12.25,13.22 12.25,12.8
  Bottom Layer w0.15: v1(13.74,14.69) 14,14.69 14.39,15.09 14.71,15.09 15.93,16.31 17.02,16.31 17.15,16.44
IMU_MOSI: length 6.7
  Top Layer w0.12: 14.57,14.61 14.57,14.55 12.82,12.8 12.82,12.13 12.7,12.01 12.64,12.01
  Bottom Layer w0.15: 17.27,15.93 15.91,15.93 v1(14.59,14.61)
IMU_SCLK: length 8
  Top Layer w0.12: 12.6,11.51 12.83,11.51 v1(13.26,11.94)
  Inner2 w0.12: 14.29,15.51 13.89,15.1 13.57,15.1 13.33,14.86 13.33,12.01 v1(13.26,11.94)
  Bottom Layer w0.15: 16.71,16.83 16.69,16.81 16.07,16.81 14.78,15.51 v1(14.3,15.51)
LED: length 19.4
  Top Layer w0.15: v1(12.72,16.32) 16.75,16.32 17.83,15.24 17.83,12.19 17.77,12.13 17.57,12.13 17.09,11.65 17.09,11.08 17.36,10.81 17.36,9.48 17.49,9.34 18.83,9.34 20,8.18
  Bottom Layer w0.15: 11.28,20.06 11.28,17.76 v1(12.72,16.32)
MOTOR_PWM1: length 9
  Top Layer w0.15: 7.74,13.04 7.27,13.5 6.41,13.5 6.23,13.32 6.22,13.32 6.09,13.18 6.09,13.17 5.75,12.84
  Top Layer w0.2: 7.15,9.62 5.76,11 5.76,12.84
  Bottom Layer w0.15: 7.75,13.02 7.75,12.41 7.26,11.92 5.87,11.92 5.85,11.93
  vias: v1(7.74,13.04)
MOTOR_PWM2: length 4.2
  Top Layer w0.15: 16.37,12.69 15.6,13.46 15.6,13.92
  Top Layer w0.2: 16.38,12.71 16.37,12.7 15.86,12.19 15.86,11.35
  Bottom Layer w0.15: 15.59,13.89 16.69,13.89 16.7,13.9
  vias: v1(15.6,13.89)
MOTOR_PWM3: length 4.9
  Top Layer w0.15: 8.89,18.62 9.93,18.62 9.93,18.62
  Top Layer w0.2: 10.88,18.97 10.55,18.63 9.93,18.62
  Bottom Layer w0.15: 6.44,17.93 8.2,17.93 8.88,18.61
  vias: v1(8.89,18.6)
MOTOR_PWM4: length 4.9
  Top Layer w0.15: v1(14.55,19.02) 14.05,19.02 ; 13.19,19.87 13.19,20.3 ; 14.05,19.01 13.19,19.87
  Top Layer w0.2: 12.01,19.94 12.55,20.48 13.14,20.48
  Bottom Layer w0.15: 15.29,20.16 15.29,19.76 v1(14.55,19.02)
PB2: length 2.4
  Bottom Layer w0.15: 19.68,13.41 17.29,13.41
PB12: length 16.1
  Bottom Layer w0.15: 15.23,8.66 15.25,8.64 15.25,7.69 14.09,6.53 10.56,6.53 9.9,5.87 9.79,5.87 9.7,5.78 9.31,5.78 ; 9.28,5.78 6.76,5.78 4.82,3.85 1.71,3.85
PB13: length 8.3
  Bottom Layer w0.15: 8.79,6.47 8.95,6.47 8.98,6.5 9.89,6.5 10.17,6.78 13.9,6.78 14.78,7.66 14.78,9.43 14.76,9.44
PB14: length 14.9
  Bottom Layer w0.15: 1.75,5.16 1.79,5.16 2.3,4.64 4.32,4.64 6.26,6.57 7.38,6.57 7.84,7.03 13.8,7.03 14.22,7.46 14.22,8.51
PB15: length 5.3
  Bottom Layer w0.15: 9.24,7.52 9.24,7.49 9.3,7.44 ; 13.76,8.61 13.75,8.6 13.75,7.86 13.18,7.29 9.98,7.29 9.69,7.57
PC6: length 2.9
  Top Layer w0.15: 11.34,6.61 11.47,6.61 12.68,7.82 v3(12.98,7.82)
  Bottom Layer w0.15: v3(12.98,7.82) 13.19,8.04 13.19,8.53
PC7: length 3.9
  Top Layer w0.15: 10.08,7.01 10.36,7.29 10.46,7.29 10.73,7.55 11.02,7.55 11.4,7.94 11.48,7.94
  Bottom Layer w0.15: 12.74,9.17 12.76,9.15 12.76,8.41 12.31,7.96 v1(11.56,7.96)
PH0: length 23.6
  Inner2 w0.15: v1(9.73,16.36) 10.47,15.61 10.47,14.64 12.61,12.5 12.61,11.78 13.13,11.26 15.7,11.26 18.08,8.88
  Bottom Layer w0.15: 21.4,5.32 19.73,7 ; 19.76,7.04 20.48,7.77 21.41,7.77 ; 9.74,20.93 9.73,20.92 9.73,16.5 ; 19.53,7.4 18.06,8.87 18.03,8.87 ; 9.73,16.5 v1(9.73,16.36) ; 9.73,16.5 9.81,16.59
  vias: v1(18.04,8.87)
PH1: length 25.9
  Bottom Layer w0.15: 10.24,20.91 10.24,15.87 16.97,9.15 16.97,6.13 ; 16.97,6.13 16.97,5.96 17.45,5.48 ; 17.4,4.34 16.93,3.87 16.62,3.87 16.21,4.28 16.21,6.21 ; 21.44,4.33 20.97,3.86 18.88,3.86 17.99,4.75
REST: length 6.9
  Bottom Layer w0.2: 10.78,21.27 10.73,21.31 10.73,22.29 10.43,22.6 6.05,22.6 5.48,22.03 5.48,21.8
SWCLK: length 2.3
  Bottom Layer w0.2: 3.32,13.02 3.32,12.87 4.73,11.46 4.88,11.46
SWDIO: length 7.3
  Bottom Layer w0.2: 3.28,11.94 3.43,11.94 5.37,10 6.09,10 7.18,11.08 8.31,11.08 8.71,10.68 8.71,10.26
VBIN: length 22.6
  Top Layer w0.12: 6.32,3.68 6.32,3.22 5.83,2.74 2.71,2.74 1.29,4.15
  Top Layer w0.6: 8.28,17.32 9.23,17.32 9.32,17.23 ; 8.22,17.32 7.22,17.32 7.2,17.3
  Top Layer w1: 8.76,6.42 10.03,5.15 10.03,3.66
  Top Layer w1.2: 8.74,6.5 8.74,16.8 8.24,17.3
  vias: v1(19.17,21.53) v2(3.94,17.28) v2(4.03,15.81) v2(4.01,14.36) v2(4.19,13.16) v2(7.26,17.29) v2(8.29,17.28) v2(8.62,11.89) v2(8.71,16.26) v2(8.71,15.37) v2(8.68,14.42) v2(8.68,13.65) v2(8.65,12.77) v2(9.19,17.26)
VCAP1: length 2.5
  Bottom Layer w0.15: 17.35,11.91 19.33,11.91 19.65,11.59 19.73,11.59
VCAP2: length 3.8
  Bottom Layer w0.15: 8.23,10.35 8.23,10.55 7.98,10.8 7.42,10.8 5.85,9.23 5.42,9.23
WS2812_PWM: length 3.9
  Bottom Layer w0.2: 17.25,18.93 19.2,18.93 19.83,19.56 20.86,19.56
$1N3956: length 2.7
  Bottom Layer w0.2: 7.78,20.41 7.28,19.91 5.34,19.91
$1N3964: length 1.9
  Bottom Layer w0.15: 10.81,6.03 10.81,5.86 10.56,5.61 10.5,5.61 10.47,5.58 9.88,5.58 9.52,5.22 9.35,5.22
$1N3968: length 4.2
  Bottom Layer w0.2: 1.83,6.29 2.82,6.29 3.53,7.01 3.53,8.43 2.97,8.99
$1N3991: length 4.6
  Bottom Layer w0.15: 12.65,5.85 11.86,5.85 11.63,5.61 11.63,4.94 10.79,4.09 10.76,4.09 10.03,3.36 10.01,3.36 9.87,3.23 9.87,3.21 9.79,3.12 9.79,2.89
$1N4023: length 4.3
  Bottom Layer w0.15: 14.36,5.96 14.18,5.78 13.67,5.78 13.61,5.72 13.61,4.93 12.74,4.06 12.74,2.68
$1N4073: length 8.7
  Top Layer w0.2: 2.76,7.43 3.57,6.63 3.61,6.63 ; 5.74,6.43 5.74,8.63 5.52,8.85 3.63,8.85 2.76,7.99 2.76,7.44 2.76,7.44
  Top Layer w0.254: R150.1 3.63,5.33
$1N11770: length 17.4
  Bottom Layer w0.15: 19.4,2.05 20.13,2.78 21.08,2.78 22.1,3.8 22.1,17.75
$1N11775: length 13.3
  Bottom Layer w0.2: 17.58,0.99 17.12,0.53 6.66,0.53 6.24,0.95 6.24,1.7 5.91,2.02 5.56,2.02
$1N11782: length 19.6
  Bottom Layer w0.15: 2.04,17.51 2.04,17.44 0.45,15.84 0.45,7.97 0.4,7.91 0.4,3.66 0.45,3.61 0.45,3.19 0.64,3 2.27,3 2.79,2.48 2.79,1.66 3.56,0.89
$1N15181: length 1.5
  Top Layer w0.15: 21.53,6.6 21.55,6.63 21.55,8.1

## Copper pours and planes (outline as drawn; the poured copper is in the pictures)
3.3V on Top Layer: 4.84,8.37 5.35,8.37 5.35,5.97 4.84,5.97
3.3V on Top Layer: 13.35,7.5 17.24,7.5 17.24,6.25 13.35,6.25
5V on Top Layer: 16.54,5.26 17.32,5.26 17.32,2.55 16.54,2.55
GND on Top Layer: -4.99,24.5 26.6,24.5 26.6,-1.3 -4.99,-1.3
GND on Bottom Layer: -1.39,23.82 24.75,23.82 24.75,-0.81 -1.39,-0.81
GND on GND: 0.26,22.74 22.74,22.74 22.74,0.26 0.26,0.26
GND on Inner2: -1.34,23.72 24.12,23.72 24.12,-0.91 -1.34,-0.91
VBIN on Top Layer: 18.31,22.35 19.82,22.35 19.82,11.75 18.31,11.75
VBIN on Top Layer: 3.18,17.91 19.82,17.91 19.82,16.71 3.18,16.71
VBIN on Top Layer: 0.57,13.45 4.75,13.45 4.75,11.86 0.57,11.86
VBIN on Top Layer: 18.18,13.51 22.51,13.51 22.51,11.76 18.18,11.76
VBIN on Top Layer: 3.18,22.41 4.67,22.41 4.67,11.87 3.18,11.87
VBIN on Top Layer: 6.06,4.27 11.25,4.27 11.25,0.34 6.06,0.34
VBIN on Inner2: 3.05,17.95 9.32,17.95 9.32,11.74 3.05,11.74
$1N4128 on Top Layer: 0.59,11.14 5.44,11.14 5.44,9.66 0.59,9.66
$1N4137 on Top Layer: 17.59,11.12 22.44,11.12 22.44,9.62 17.59,9.62
$1N4155 on Top Layer: 14.92,22.42 17.41,22.42 17.41,18.93 14.92,18.93
$1N14614 on Top Layer: 5.59,22.44 8.18,22.44 8.18,19.08 5.59,19.08

Small or netless copper shapes (teardrops, artwork), in the pictures only: 87 on Top Layer, 127 on Bottom Layer, 8 on GND, 12 on Inner2

## Text on the board
Top Silkscreen Layer: 1S 3.7V / MAX:6V | 23 X 23 | V | R | T | G | aBo_F405mini
